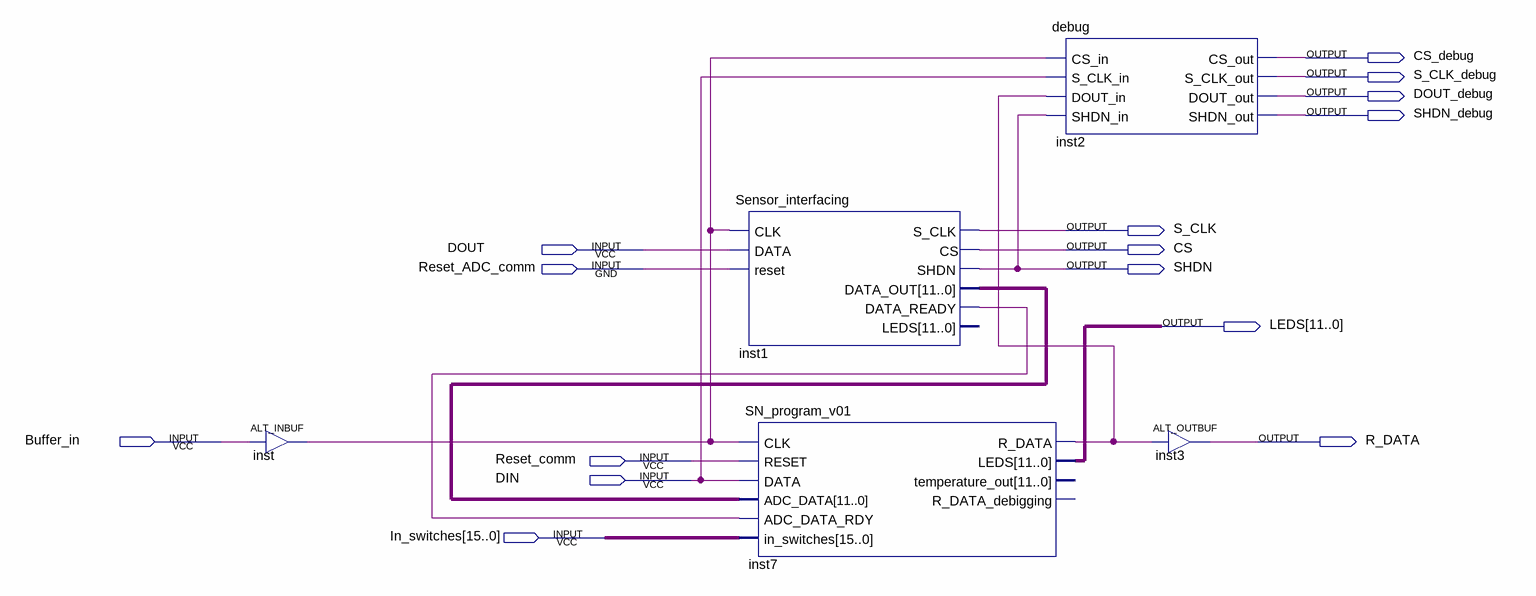
[diagram p0: schematic sheet]
// Quartus schematic SN_PROGRAM_V02.bdf as structural Verilog: 5 symbols, 15 pins
module SN_PROGRAM_V02 (
  input  DOUT,
  input  Reset_ADC_comm,
  input  Buffer_in,
  input  Reset_comm,
  input  DIN,
  input  [15:0] In_switches,
  output CS_debug,
  output S_CLK_debug,
  output DOUT_debug,
  output SHDN_debug,
  output S_CLK,
  output CS,
  output SHDN,
  output [11:0] LEDS,
  output R_DATA
);

  wire inst1_data_ready, inst7_r_data, inst_o;
  wire [11:0] inst1_data_out;

  ALT_INBUF inst (.i(Buffer_in), .o(inst_o));
  Sensor_interfacing inst1 (
    .CLK(inst_o), .DATA(DOUT), .reset(Reset_ADC_comm), .S_CLK(S_CLK), .CS(CS), .SHDN(SHDN),
    .DATA_OUT(inst1_data_out), .DATA_READY(inst1_data_ready));  // open: LEDS
  SN_program_v01 inst7 (
    .CLK(inst_o), .RESET(Reset_comm), .DATA(DIN), .ADC_DATA(inst1_data_out), .ADC_DATA_RDY(inst1_data_ready),
    .in_switches(In_switches), .R_DATA(inst7_r_data), .LEDS(LEDS));  // open: temperature_out, R_DATA_debigging
  debug inst2 (
    .CS_in(inst_o), .S_CLK_in(DIN), .DOUT_in(inst7_r_data), .SHDN_in(SHDN), .CS_out(CS_debug),
    .S_CLK_out(S_CLK_debug), .DOUT_out(DOUT_debug), .SHDN_out(SHDN_debug));
  ALT_OUTBUF inst3 (.i(inst7_r_data), .o(R_DATA));
endmodule
